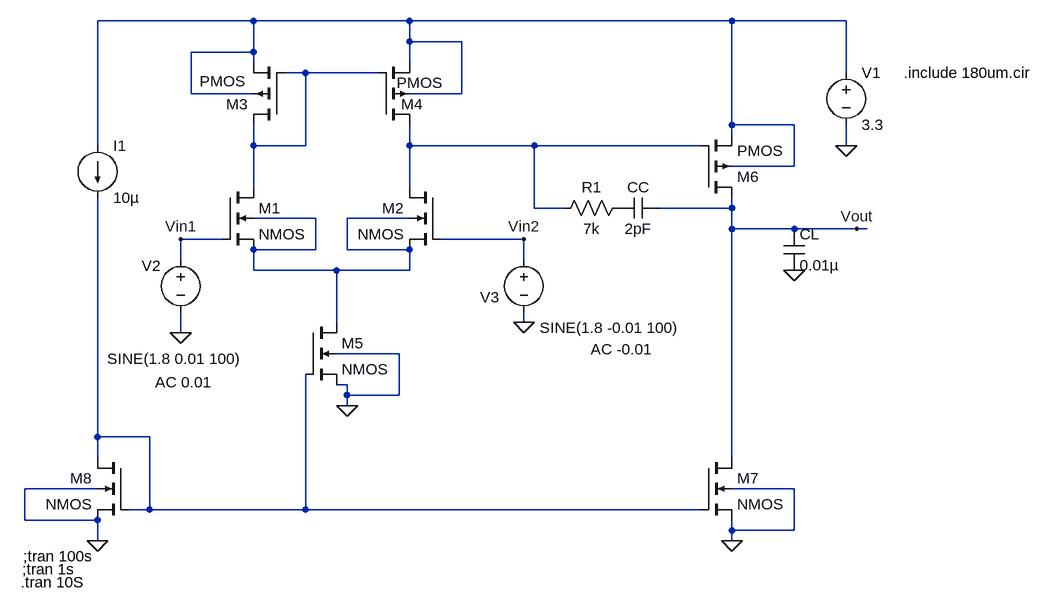
[diagram p0: schematic LTSpice Schematic - 2 Stage Op-Amp.asc]
LTSpice Schematic - 2 Stage Op-Amp.asc, the LTspice schematic file:
Version 4
SHEET 1 2416 1692
WIRE 128 -112 -112 -112
WIRE 368 -112 128 -112
WIRE 864 -112 368 -112
WIRE 1040 -112 864 -112
WIRE 368 -80 368 -112
WIRE 448 -80 368 -80
WIRE 128 -64 128 -112
WIRE 128 -64 32 -64
WIRE 128 -48 128 -64
WIRE 368 -48 368 -80
WIRE 208 -32 176 -32
WIRE 320 -32 208 -32
WIRE 1040 -32 1040 -112
WIRE 32 0 32 -64
WIRE 128 0 32 0
WIRE 448 0 448 -80
WIRE 448 0 368 0
WIRE 864 48 864 -112
WIRE 960 48 864 48
WIRE 864 64 864 48
WIRE -112 80 -112 -112
WIRE 128 80 128 48
WIRE 208 80 208 -32
WIRE 208 80 128 80
WIRE 368 80 368 48
WIRE 560 80 368 80
WIRE 816 80 560 80
WIRE 1040 80 1040 48
WIRE 960 112 960 48
WIRE 960 112 864 112
WIRE 128 144 128 80
WIRE 368 144 368 80
WIRE 560 176 560 80
WIRE 608 176 560 176
WIRE 864 176 864 160
WIRE 864 176 752 176
WIRE 224 192 128 192
WIRE 368 192 272 192
WIRE 864 208 864 176
WIRE 960 208 864 208
WIRE 1056 208 960 208
WIRE 1072 208 1056 208
WIRE 80 224 16 224
WIRE 544 224 416 224
WIRE 224 240 224 192
WIRE 224 240 128 240
WIRE 272 240 272 192
WIRE 368 240 272 240
WIRE 16 256 16 224
WIRE 544 256 544 224
WIRE 128 272 128 240
WIRE 256 272 128 272
WIRE 368 272 368 240
WIRE 368 272 256 272
WIRE 256 352 256 272
WIRE 544 352 544 336
WIRE 16 368 16 336
WIRE 352 400 256 400
WIRE 272 448 256 448
WIRE 272 464 272 448
WIRE 352 464 352 400
WIRE 352 464 272 464
WIRE 272 480 272 464
WIRE -112 528 -112 160
WIRE -32 528 -112 528
WIRE -112 560 -112 528
WIRE 864 560 864 208
WIRE -112 608 -224 608
WIRE 960 608 864 608
WIRE -32 640 -32 528
WIRE -32 640 -64 640
WIRE 208 640 208 432
WIRE 208 640 -32 640
WIRE 816 640 208 640
WIRE -224 656 -224 608
WIRE -112 656 -224 656
WIRE 864 672 864 656
WIRE 960 672 960 608
WIRE 960 672 864 672
WIRE -112 688 -112 656
WIRE 864 688 864 672
FLAG 1040 80 0
FLAG 16 368 0
FLAG 544 352 0
FLAG 1056 208 Vout
FLAG -112 688 0
FLAG 272 480 0
FLAG 864 688 0
FLAG 16 224 Vin1
FLAG 544 224 Vin2
FLAG 960 272 0
SYMBOL nmos4 80 144 R0
SYMATTR InstName M1
SYMATTR Value2 l=1um w=20um
SYMBOL nmos4 208 352 R0
SYMATTR InstName M5
SYMATTR Value2 l=1um w=39um
SYMBOL nmos4 -64 560 M0
SYMATTR InstName M8
SYMATTR Value2 l=1u w=10u
SYMBOL current -112 80 R0
WINDOW 123 0 0 Left 2
WINDOW 39 0 0 Left 2
SYMATTR InstName I1
SYMATTR Value 10µ
SYMBOL pmos4 176 48 R180
WINDOW 3 60 67 Left 2
SYMATTR InstName M3
SYMATTR Value2 l=1um w=50um
SYMBOL pmos4 320 48 M180
WINDOW 0 35 32 Left 2
WINDOW 3 28 65 Left 2
SYMATTR InstName M4
SYMATTR Value2 l=1um w=50um
SYMBOL voltage 1040 -48 R0
WINDOW 123 0 0 Left 2
WINDOW 39 0 0 Left 2
SYMATTR InstName V1
SYMATTR Value 3.3
SYMBOL voltage 16 240 R0
WINDOW 123 -39 204 Left 2
WINDOW 39 0 0 Left 2
WINDOW 3 -113 168 Left 2
WINDOW 0 -60 25 Left 2
SYMATTR Value2 AC 0.01
SYMATTR Value SINE(1.8 0.01 100)
SYMATTR InstName V2
SYMBOL nmos4 416 144 M0
SYMATTR InstName M2
SYMATTR Value2 l=1um w=20um
SYMBOL voltage 544 240 R0
WINDOW 0 -67 73 Left 2
WINDOW 3 24 120 Left 2
WINDOW 123 103 153 Left 2
WINDOW 39 0 0 Left 2
SYMATTR InstName V3
SYMATTR Value SINE(1.8 -0.01 100)
SYMATTR Value2 AC -0.01
SYMBOL pmos4 816 160 M180
SYMATTR InstName M6
SYMATTR Value2 l=180n w=20u
SYMBOL nmos4 816 560 R0
SYMATTR InstName M7
SYMATTR Value2 l=1u w=30u
SYMBOL cap 752 160 R90
WINDOW 0 0 32 VBottom 2
WINDOW 3 32 32 VTop 2
SYMATTR InstName CC
SYMATTR Value 2pF
SYMBOL res 704 160 R90
WINDOW 0 0 56 VBottom 2
WINDOW 3 32 56 VTop 2
SYMATTR InstName R1
SYMATTR Value 7k
SYMBOL cap 944 208 R0
SYMATTR InstName CL
SYMATTR Value 0.01µ
TEXT 1128 -32 Left 2 !.include 180um.cir
TEXT -226 712 Left 2 !;tran 100s
TEXT -228 732 Left 2 !;tran 1s
TEXT -230 752 Left 2 !.tran 10S

The netlist it stands for:
* LTSpice Schematic - 2 Stage Op-Amp.asc
M1 N002 Vin1 N004 N004 NMOS l=1um w=20um
M5 N004 N005 0 0 NMOS l=1um w=39um
M8 N005 N005 0 0 NMOS l=1u w=10u
I1 N001 N005 10µ
M3 N002 N002 N001 N001 PMOS l=1um w=50um
M4 N003 N002 N001 N001 PMOS l=1um w=50um
V1 N001 0 3.3
V2 Vin1 0 SINE(1.8 0.01 100) AC 0.01
M2 N003 Vin2 N004 N004 NMOS l=1um w=20um
V3 Vin2 0 SINE(1.8 -0.01 100) AC -0.01
M6 Vout N003 N001 N001 PMOS l=180n w=20u
M7 Vout N005 0 0 NMOS l=1u w=30u
CC Vout P001 2pF
R1 P001 N003 7k
CL Vout 0 0.01µ
.model NMOS NMOS
.model PMOS PMOS
.lib standard.mos
.include 180um.cir
;tran 100s
;tran 1s
.tran 10S
.backanno
.end